# Altium project US_EMG_PROTO1.PrjPcb
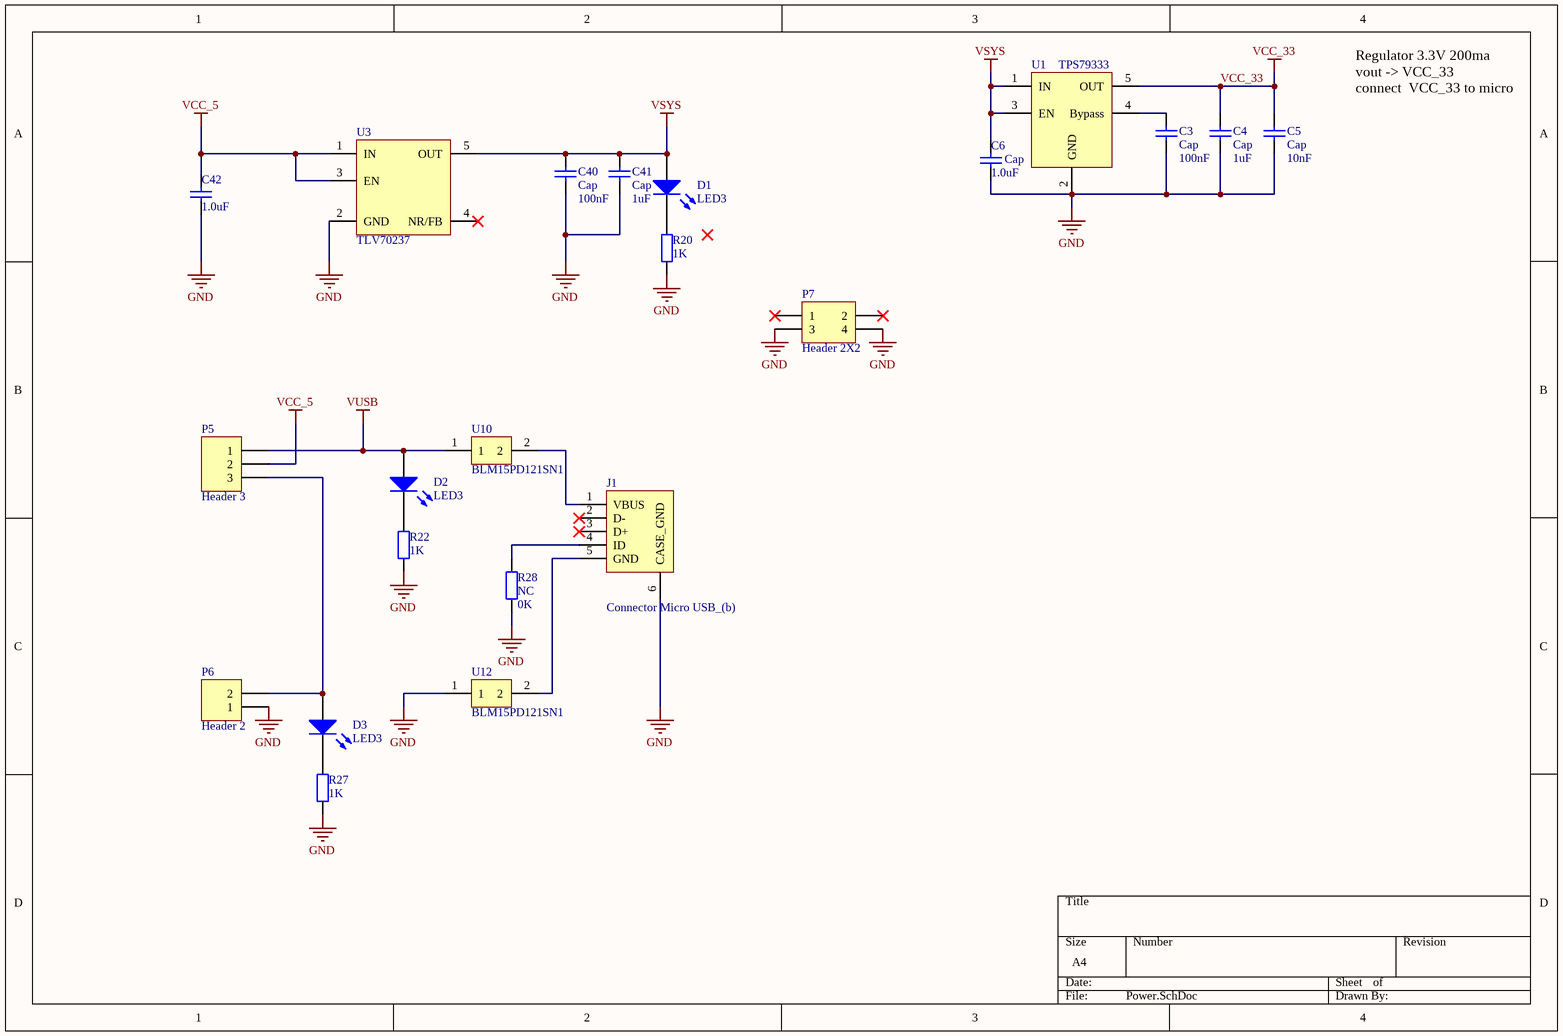
[diagram p0: Power.SchDoc]
4 sheets, 141 parts. Net scope: flat (ports and power ports of the same name join across sheets).
Board file: PCB2_DEMO_BOARD.PcbDoc
Sheets:
  Power.SchDoc
  Power_Cerebro.SchDoc
  ADS1298_2.SchDoc
  Cerebro.SchDoc

## Sheet Power.SchDoc
size A4

### Parts
C3  Cap  value 100nF  [cap_0402_R - modified]
C4  Cap  value 1uF  [cap_0402_R - modified]
C5  Cap  value 10nF  [cap_0402_R - modified]
C6  Cap  value 1.0uF  [cap_0402_R - modified]
C40  Cap  value 100nF  [cap_0402_R - modified]
C41  Cap  value 1uF  [cap_0402_R - modified]
C42  value 1.0uF  [cap_0402_R - modified]  (hidden comment: Cap)
D1  LED3  [0603]
D2  LED3  [0603]
D3  LED3  [0603]
J1  Connector Micro USB_(b)  [CONNECTOR_MICRO_USB_B_TYPE]
P5  Header 3  [HDR1X3]
P6  Header 2  [HDR1X2]
P7  Header 2X2  [HDR2X2]
R20  value 1K  [0603]  (hidden comment: R)
R22  value 1K  [0603]  (hidden comment: R)
R27  value 1K  [0603]  (hidden comment: R)
R28  NC  value 0K  [cap_0402_R - modified]
U1  TPS79333  [SOT_23__DBV_(R - PDSO - G5)]
U3  TLV70237  [SOT23__DDC__(R - PDSO-  G5)]
U10  BLM15PD121SN1  [BLM15PD121SN1]
U12  BLM15PD121SN1  [BLM15PD121SN1]

### Nets
GND: C3.1 C4.2 C5.1 C6.1 C40.1 C41.2 C42.1 J1.6(CASE_GND) P6.1 P7.3 P7.4 R20.1 R22.1 R27.1 R28.1 U1.2(GND) U3.2(GND) U12.1
VCC_5: C42.2 P5.2 U3.1(IN) U3.3(EN)
VCC_33: C4.1 C5.2 U1.5(OUT)
VSYS: C6.2 C40.2 C41.1 D1.1(A) U1.1(IN) U1.3(EN) U3.5(OUT)
VUSB: D2.1(A) P5.1 U10.1
NetC3_2: C3.2 U1.4(Bypass)
NetD1_2: D1.2(K) R20.2
NetD2_2: D2.2(K) R22.2
NetD3_1: D3.1(A) P5.3 P6.2
NetD3_2: D3.2(K) R27.2
NetJ1_1: J1.1(VBUS) U10.2
NetJ1_4: J1.4(ID) R28.2
NetJ1_5: J1.5(GND) U12.2

Not connected (* = marked no-connect by the designer): J1 2(D-)* 3(D+)*; P7 1* 2*; U3 4(NR/FB)*

### Notes on the sheet
- Regulator 3.3V 200ma
  vout -> VCC_33
  connect  VCC_33 to micro

### Library data of the parts
C3-C6 C40-C42 = Cap: Capacitor; Published: 8-Jun-2000; LatestRevisionDate: 17-Jul-2002; LatestRevisionNote: Re-released for DXP Platform.; PackageReference: RAD-0.3; Publisher: Altium Limited; PackageDescription: Radial Cap, Thru-Hole; 2 Leads; 0.3 in Pin Spacing
D1-D3 = LED3: Typical BLUE SiC LED; Published: 8-Jun-2000; LatestRevisionDate: 17-Dec-2003; LatestRevisionNote: PCB Footprint replaced.; DatasheetVersion: 16-Apr-2002; PackageVersion: 16-Apr-2002; PackageReference: 3.5X2.8X1.9; Publisher: Altium Limited; PackageDescription: SM LED; 2 C-Bend Leads; Body 3.5 x 2.8 x 1.9 mm, inc leads (LxWxH typ)
J1 = Connector Micro USB_(b): CONNECTOR MICRO USB
P5 = Header 3: Header, 3-Pin; LatestRevisionDate: 17-Jul-2002; LatestRevisionNote: Re-released for DXP Platform.; Publisher: Altium Limited
P6 = Header 2: Header, 2-Pin; LatestRevisionDate: 17-Jul-2002; LatestRevisionNote: Re-released for DXP Platform.; Publisher: Altium Limited
P7 = Header 2X2: Header, 2-Pin, Dual row; LatestRevisionDate: 17-Jul-2002; LatestRevisionNote: Re-released for DXP Platform.; Publisher: Altium Limited
R20 R22 R27 R28 = Res2: Resistor; Published: 8-Jun-2000; LatestRevisionDate: 17-Jul-2002; LatestRevisionNote: Re-released for DXP Platform.; PackageReference: AXIAL-0.4; Publisher: Altium Limited; PackageDescription: Axial Device, Thru-Hole; 2 Leads; 0.4 in Pin Spacing
U1 = TPS79333: Regulator
U3 = TLV70237: Linear Regulator

## Sheet Power_Cerebro.SchDoc
size A4
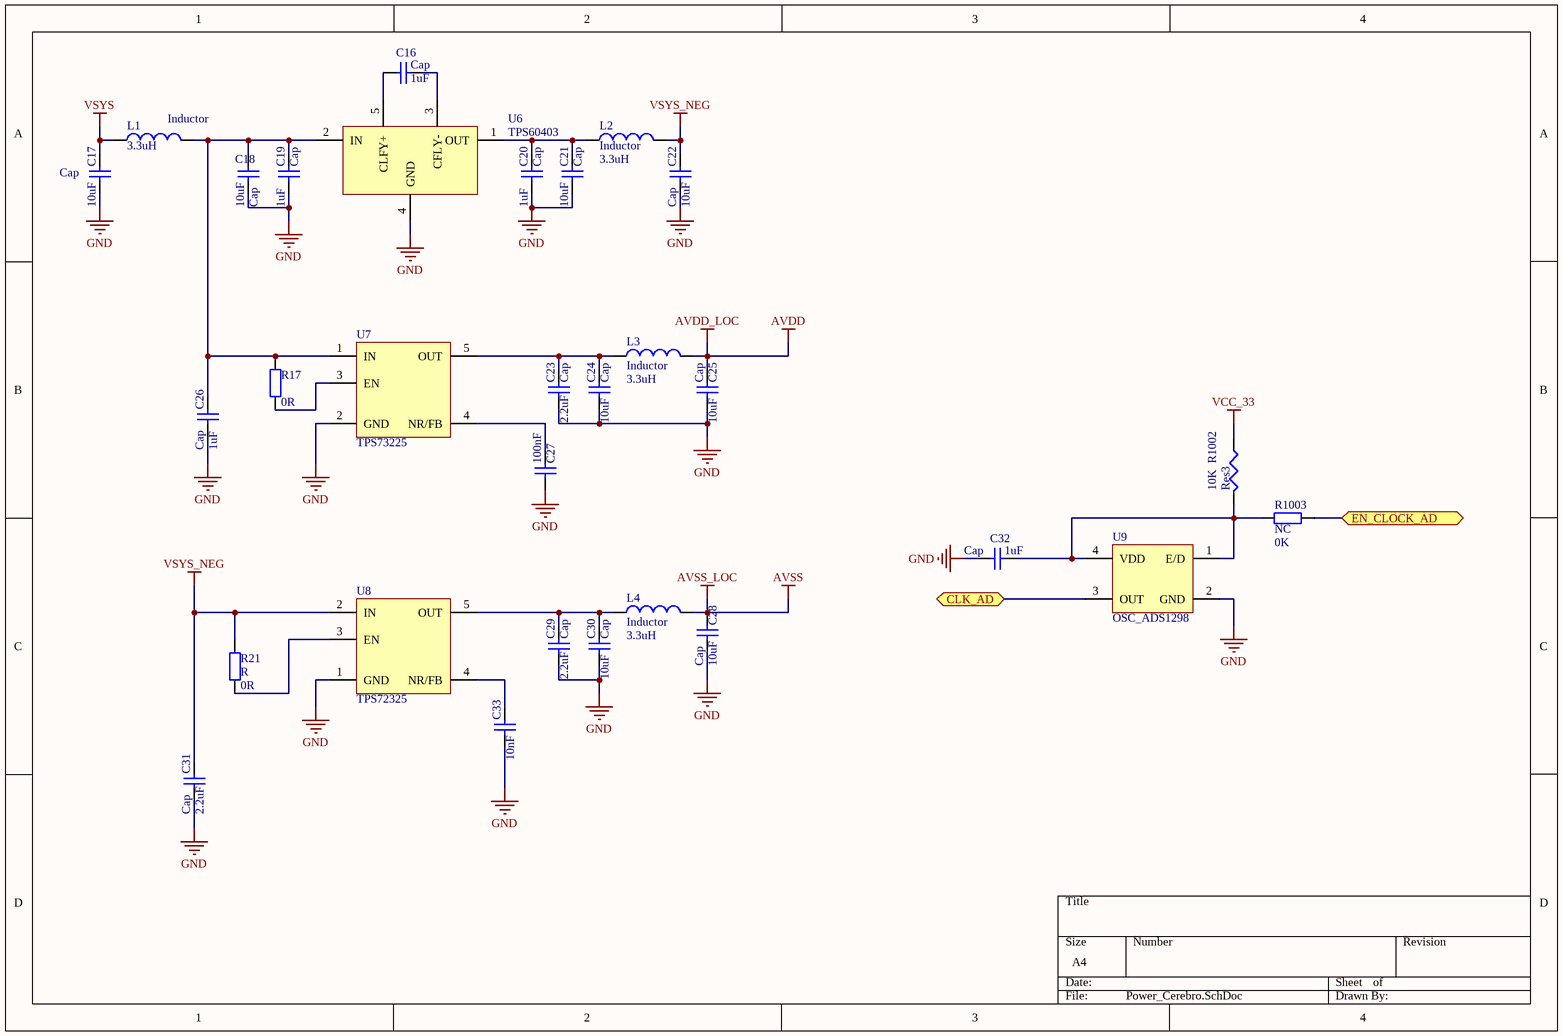
[diagram p1: Power_Cerebro.SchDoc]

### Parts
C16  Cap  value 1uF  [cap_0402_R - modified]
C17  Cap  value 10uF  [cap_0402_R - modified]
C18  Cap  value 10uF  [cap_0402_R - modified]
C19  Cap  value 1uF  [cap_0402_R - modified]
C20  Cap  value 1uF  [cap_0402_R - modified]
C21  Cap  value 10uF  [cap_0402_R - modified]
C22  Cap  value 10uF  [cap_0402_R - modified]
C23  Cap  value 2.2uF  [cap_0402_R - modified]
C24  Cap  value 10uF  [cap_0402_R - modified]
C25  Cap  value 10uF  [cap_0402_R - modified]
C26  Cap  value 1uF  [cap_0402_R - modified]
C27  value 100nF  [cap_0402_R - modified]  (hidden comment: C)
C28  Cap  value 10uF  [cap_0402_R - modified]
C29  Cap  value 2.2uF  [cap_0402_R - modified]
C30  Cap  value 10uF  [cap_0402_R - modified]
C31  Cap  value 2.2uF  [cap_0402_R - modified]
C32  Cap  value 1uF  [cap_0402_R - modified]
C33  value 10nF  [cap_0402_R - modified]  (hidden comment: C)
L1  Inductor  value 3.3uH  [0603]
L2  Inductor  value 3.3uH  [0603]
L3  Inductor  value 3.3uH  [0603]
L4  Inductor  value 3.3uH  [0603]
R17  value 0R  [cap_0402_R - modified]  (hidden comment: R)
R21  R  value 0R  [cap_0402_R - modified]
R1002  Res3  value 10K  [res_0402_R - modified]
R1003  NC  value 0K  [cap_0402_R - modified]
U6  TPS60403  [SOT_23__DBV_(R - PDSO - G5)]
U7  TPS73225  [SOT23__DDC__(R - PDSO-  G5)]
U8  TPS72325  [SOT23__DDC__(R - PDSO-  G5)]
U9  OSC_ADS1298  [HC735 - OSC ADS1298]

### Ports
CLK_AD (bidir), EN_CLOCK_AD (bidir)

### Nets
AVDD: C25.1 L3.2  [also labelled AVDD_LOC]
AVSS: C28.1 L4.2  [also labelled AVSS_LOC]
GND: C17.2 C18.2 C19.2 C20.2 C21.2 C22.2 C23.2 C24.2 C25.2 C26.2 C27.2 C28.2 C29.2 C30.2 C31.2 C32.2 C33.2 U6.4(GND) U7.2(GND) U8.1(GND) U9.2(GND)
VCC_33: R1002.1
VSYS: C17.1 L1.1
VSYS_NEG: C22.1 C31.1 L2.2 R21.1 U8.2(IN)
NetC16_1: C16.1 U6.3(CFLY-)
NetC16_2: C16.2 U6.5(CLFY+)
NetC18_1: C18.1 C19.1 C26.1 L1.2 R17.2 U6.2(IN) U7.1(IN)
NetC20_1: C20.1 C21.1 L2.1 U6.1(OUT)
NetC23_1: C23.1 C24.1 L3.1 U7.5(OUT)
NetC27_1: C27.1 U7.4(NR/FB)
NetC29_1: C29.1 C30.1 L4.1 U8.5(OUT)
NetC32_1: C32.1 R1002.2 R1003.2 U9.1(E/D) U9.4(VDD)
NetC33_1: C33.1 U8.4(NR/FB)
NetP2_12: R1003.1 ; port EN_CLOCK_AD
NetR17_1: R17.1 U7.3(EN)
NetR21_2: R21.2 U8.3(EN)
NetU9_3: U9.3(OUT) ; port CLK_AD

### Library data of the parts
C16-C33 = Cap: Capacitor; Published: 8-Jun-2000; LatestRevisionDate: 17-Jul-2002; LatestRevisionNote: Re-released for DXP Platform.; PackageReference: RAD-0.3; Publisher: Altium Limited; PackageDescription: Radial Cap, Thru-Hole; 2 Leads; 0.3 in Pin Spacing
L1-L4 = Inductor: Code_IEC: 1005; Published: 8-Jun-2000; LatestRevisionDate: 29-May-2009; LatestRevisionNote: IPC-7351 Footprint Added.; PackageReference: 0402-A; Publisher: Altium Limited; PackageDescription: Chip Inductor; Code_JEITA: 0402
R17 R21 R1003 = Res2: Resistor; Published: 8-Jun-2000; LatestRevisionDate: 17-Jul-2002; LatestRevisionNote: Re-released for DXP Platform.; PackageReference: AXIAL-0.4; Publisher: Altium Limited; PackageDescription: Axial Device, Thru-Hole; 2 Leads; 0.4 in Pin Spacing
R1002 = Res3: Resistor; Published: 8-Jun-2000; LatestRevisionDate: 29-May-2009; LatestRevisionNote: IPC-7351 Footprint Added.; PackageReference: J1-0603; Publisher: Altium Limited; PackageDescription: Chip Resistor
U6 = TPS60403: Linear Regulator
U7 = TPS73225: Linear Regulator
U8 = TPS72325: Linear Regulator
U9 = OSC_ADS1298: Linear Regulator

## Sheet ADS1298_2.SchDoc
size A4
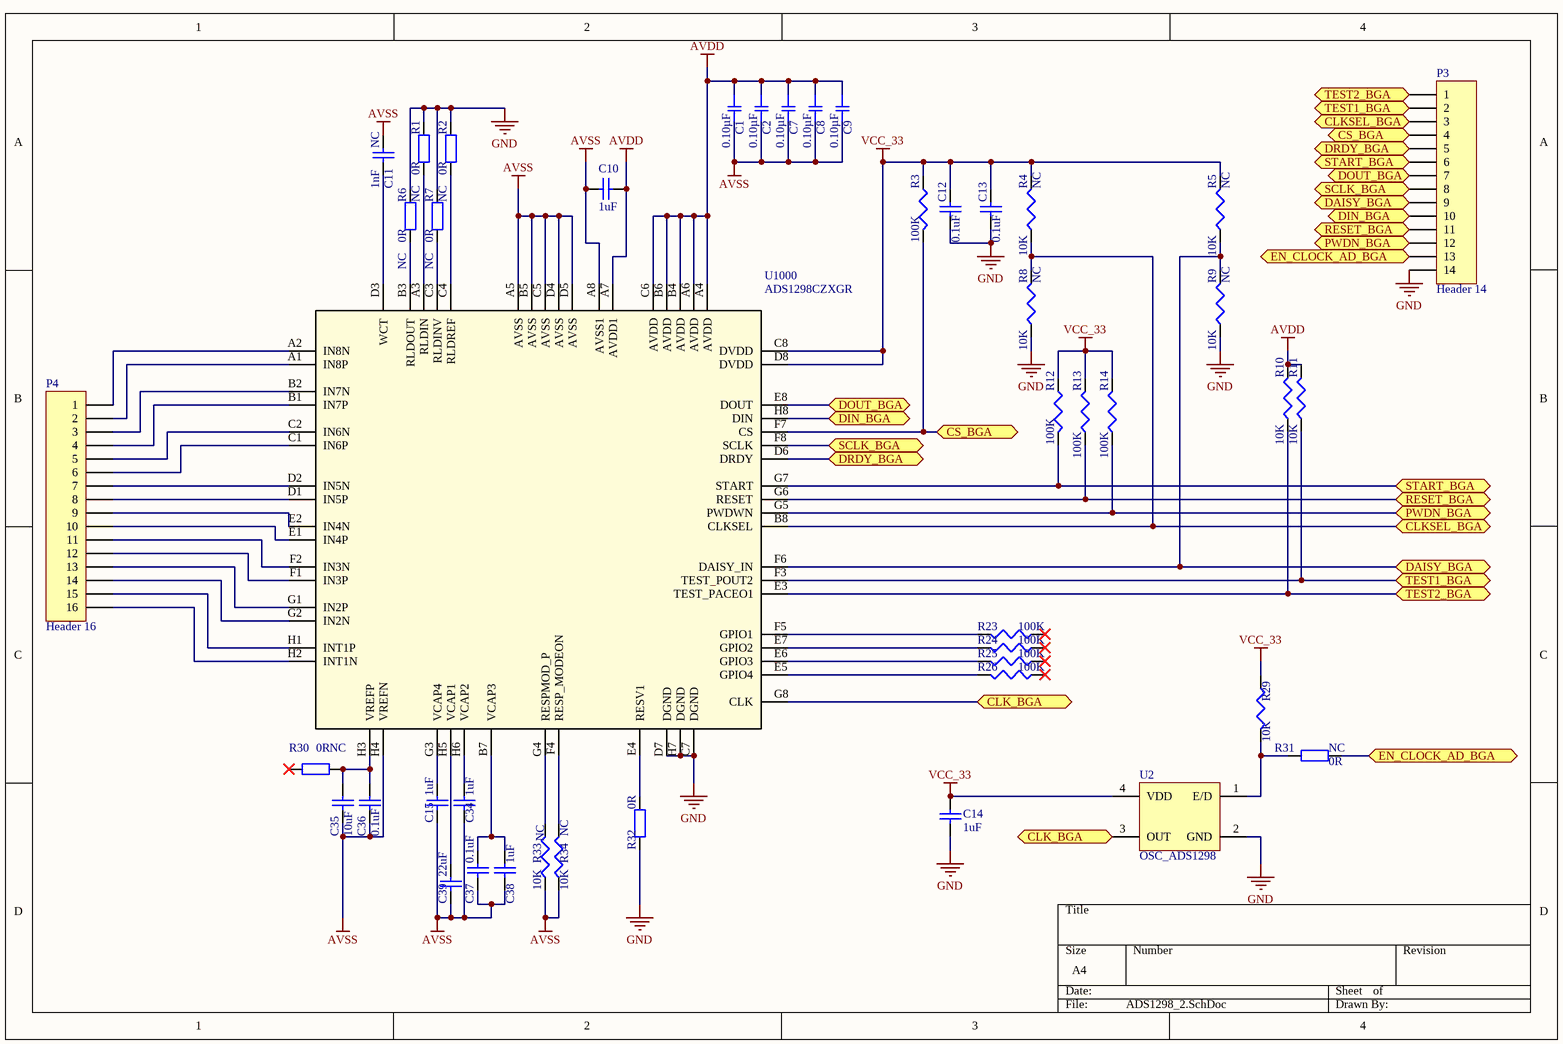
[diagram p2: ADS1298_2.SchDoc]

### Parts
C1  0.10µF  [SMD-0201C]
C2  0.10µF  [SMD-0201C]
C7  0.10µF  [SMD-0201C]
C8  0.10µF  [SMD-0201C]
C9  0.10µF  [SMD-0201C]
C10  value 1uF  [cap_0402_R - modified]  (hidden comment: Cap)
C11  NC  value 1nF  [cap_0402_R - modified]
C12  value 0.1uF  [cap_0402_R - modified]  (hidden comment: Cap)
C13  value 0.1uF  [cap_0402_R - modified]  (hidden comment: Cap)
C14  value 1uF  [cap_0402_R - modified]  (hidden comment: Cap)
C15  value 1uF  [cap_0402_R - modified]  (hidden comment: Cap)
C34  value 1uF  [cap_0402_R - modified]  (hidden comment: Cap)
C35  value 10uF  [cap_0402_R - modified]  (hidden comment: Cap)
C36  value 0.1uF  [cap_0402_R - modified]  (hidden comment: Cap)
C37  value 0.1uF  [cap_0402_R - modified]  (hidden comment: Cap)
C38  value 1uF  [cap_0402_R - modified]  (hidden comment: Cap)
C39  value 22uF  [cap_0402_R - modified]  (hidden comment: Cap)
P3  Header 14  [61301421121]
P4  Header 16  [61301621121]
R1  NC  value 0R  [cap_0402_R - modified]
R2  NC  value 0R  [cap_0402_R - modified]
R3  value 100K  [res_0402_R - modified]  (hidden comment: Res3)
R4  NC  value 10K  [cap_0402_R - modified]
R5  NC  value 10K  [cap_0402_R - modified]
R6  NC  value 0R  [cap_0402_R - modified]
R7  NC  value 0R  [cap_0402_R - modified]
R8  NC  value 10K  [cap_0402_R - modified]
R9  NC  value 10K  [cap_0402_R - modified]
R10  value 10K  [cap_0402_R - modified]
R11  value 10K  [cap_0402_R - modified]
R12  value 100K  [res_0402_R - modified]  (hidden comment: Res3)
R13  value 100K  [res_0402_R - modified]  (hidden comment: Res3)
R14  value 100K  [res_0402_R - modified]  (hidden comment: Res3)
R23  value 100K  [res_0402_R - modified]  (hidden comment: Res3)
R24  value 100K  [res_0402_R - modified]  (hidden comment: Res3)
R25  value 100K  [res_0402_R - modified]  (hidden comment: Res3)
R26  value 100K  [res_0402_R - modified]  (hidden comment: Res3)
R29  value 10K  [res_0402_R - modified]  (hidden comment: Res3)
R30  NC  value 0R  [cap_0402_R - modified]
R31  NC  value 0R  [cap_0402_R - modified]
R32  value 0R  [cap_0402_R - modified]
R33  NC  value 10K  [cap_0402_R - modified]
R34  NC  value 10K  [res_0402_R - modified]
U2  OSC_ADS1298  [HC735 - OSC ADS1298]
U1000  ADS1298CZXGR  [BGA64C80P8X8_800X800X106]

### Ports
CLK_BGA, CLKSEL_BGA, CS_BGA, DAISY_BGA, DIN_BGA, DOUT_BGA, DRDY_BGA, EN_CLOCK_AD_BGA (bidir), PWDN_BGA, RESET_BGA, SCLK_BGA, START_BGA, TEST1_BGA, TEST2_BGA

### Nets
AVDD: C1.1 C2.1 C7.1 C8.1 C9.1 C10.1 R10.2 R11.2 U1000.A4(AVDD) U1000.A6(AVDD) U1000.A7(AVDD1) U1000.B4(AVDD) U1000.B6(AVDD) U1000.C6(AVDD)
AVSS: C1.2 C2.2 C7.2 C8.2 C9.2 C10.2 C11.1 C15.1 C34.1 C35.1 C36.1 C37.1 C38.1 C39.1 R33.1 R34.1 U1000.A5(AVSS) U1000.A8(AVSS1) U1000.B5(AVSS) U1000.C5(AVSS) U1000.D4(AVSS) U1000.D5(AVSS) U1000.H4(VREFN)
GND: C12.1 C13.1 C14.2 P3.14 R1.1 R2.1 R6.1 R7.1 R8.1 R9.1 R32.2 U2.2(GND) U1000.C7(DGND) U1000.D7(DGND) U1000.H7(DGND)
VCC_33: C12.2 C13.2 C14.1 R3.1 R4.2 R5.2 R12.1 R13.2 R14.2 R29.1 U2.4(VDD) U1000.C8(DVDD) U1000.D8(DVDD)
NetC11_2: C11.2 U1000.D3(WCT)
NetC15_2: C15.2 U1000.G3(VCAP4)
NetC34_2: C34.2 U1000.H6(VCAP2)
NetC35_2: C35.2 C36.2 R30.2 U1000.H3(VREFP)
NetC37_2: C37.2 C38.2 U1000.B7(VCAP3)
NetC39_2: C39.2 U1000.H5(VCAP1)
NetP3_1: P3.1 R10.1 U1000.E3(TEST_PACEO1) ; port TEST2_BGA
NetP3_2: P3.2 R11.1 U1000.F3(TEST_POUT2) ; port TEST1_BGA
NetP3_3: P3.3 R4.1 R8.2 U1000.B8(CLKSEL) ; port CLKSEL_BGA
NetP3_4: P3.4 R3.2 U1000.F7(CS) ; port CS_BGA
NetP3_5: P3.5 U1000.D6(DRDY) ; port DRDY_BGA
NetP3_6: P3.6 R12.2 U1000.G7(START) ; port START_BGA
NetP3_7: P3.7 U1000.E8(DOUT) ; port DOUT_BGA
NetP3_8: P3.8 U1000.F8(SCLK) ; port SCLK_BGA
NetP3_9: P3.9 R5.1 R9.2 U1000.F6(DAISY_IN) ; port DAISY_BGA
NetP3_10: P3.10 U1000.H8(DIN) ; port DIN_BGA
NetP3_11: P3.11 R13.1 U1000.G6(RESET) ; port RESET_BGA
NetP3_12: P3.12 R14.1 U1000.G5(PWDWN) ; port PWDN_BGA
NetP3_13: P3.13 R31.1 ; port EN_CLOCK_AD_BGA
NetP4_1: P4.1 U1000.A2(IN8N)
NetP4_2: P4.2 U1000.A1(IN8P)
NetP4_3: P4.3 U1000.B2(IN7N)
NetP4_4: P4.4 U1000.B1(IN7P)
NetP4_5: P4.5 U1000.C2(IN6N)
NetP4_6: P4.6 U1000.C1(IN6P)
NetP4_7: P4.7 U1000.D2(IN5N)
NetP4_8: P4.8 U1000.D1(IN5P)
NetP4_9: P4.9 U1000.E2(IN4N)
NetP4_10: P4.10 U1000.E1(IN4P)
NetP4_11: P4.11 U1000.F2(IN3N)
NetP4_12: P4.12 U1000.F1(IN3P)
NetP4_13: P4.13 U1000.G1(IN2P)
NetP4_14: P4.14 U1000.G2(IN2N)
NetP4_15: P4.15 U1000.H1(INT1P)
NetP4_16: P4.16 U1000.H2(INT1N)
NetR1_2: R1.2 U1000.A3(RLDIN)
NetR2_2: R2.2 U1000.C4(RLDREF)
NetR6_2: R6.2 U1000.B3(RLDOUT)
NetR7_2: R7.2 U1000.C3(RLDINV)
NetR23_2: R23.2 U1000.F5(GPIO1)
NetR24_2: R24.2 U1000.E7(GPIO2)
NetR25_2: R25.2 U1000.E6(GPIO3)
NetR26_2: R26.2 U1000.E5(GPIO4)
NetR29_2: R29.2 R31.2 U2.1(E/D)
NetR32_1: R32.1 U1000.E4(RESV1)
NetR33_2: R33.2 U1000.G4(RESPMOD_P)
NetR34_2: R34.2 U1000.F4(RESP_MODEON)
NetU2_3: U2.3(OUT) U1000.G8(CLK) ; port CLK_BGA

Not connected (* = marked no-connect by the designer): R23 1*; R24 1*; R25 1*; R26 1*; R30 1*

### Library data of the parts
C1 C2 C7-C9 = GRT033C81A104KE01D: CAP CER 0.1UF 10V X6S 0201; Manufacturer: Murata Electronics North America; Factory Stock: 0; Unit Price (USD): 0.1; Minimum Quantity: 1; Tolerance: ±10%; Datasheets: http://search.murata.co.jp/Ceramy/image/img/A01X/G101/ENG/GRT033C81A104KE01-01.pdf; Image: //media.digikey.com/Renders/Murata%20Renders/GRT%20Series%200201%20(0603%20Metric).jpg; Digi-Key Part Number: 490-12232-1-ND; Part Number: GRT033C81A104KE01D; Quantity Available: 1647; @ qty: 0; Packaging: Cut Tape (CT); Series: GRT; Part Status: Active; Value: 0.10µF; Voltage: 10V; Temperature Coefficient: X6S; Operating Temperature: -55°C ~ 105°C; Features: -; Ratings: AEC-Q200; Applications: Automotive; Failure Rate: Surface Mount, MLCC; Mounting Type: 0201 (0603 Metric); Package / Case: 0.024" L x 0.012" W (0.60mm x 0.30mm); Size / Dimension: -; Height - Seated (Max): 0.013" (0.33mm); Thickness (Max): -; Lead Spacing: -
C10-C15 C34-C39 = Cap: Capacitor; Published: 8-Jun-2000; LatestRevisionDate: 17-Jul-2002; LatestRevisionNote: Re-released for DXP Platform.; PackageReference: RAD-0.3; Publisher: Altium Limited; PackageDescription: Radial Cap, Thru-Hole; 2 Leads; 0.3 in Pin Spacing
P3 = Header 14: Header, 14-Pin; LatestRevisionDate: 17-Jul-2002; LatestRevisionNote: Re-released for DXP Platform.; Publisher: Altium Limited
P4 = Header 16: Header, 16-Pin; LatestRevisionDate: 17-Jul-2002; LatestRevisionNote: Re-released for DXP Platform.; Publisher: Altium Limited
R1 R2 R6 R7 R30-R32 = Res2: Resistor; Published: 8-Jun-2000; LatestRevisionDate: 17-Jul-2002; LatestRevisionNote: Re-released for DXP Platform.; PackageReference: AXIAL-0.4; Publisher: Altium Limited; PackageDescription: Axial Device, Thru-Hole; 2 Leads; 0.4 in Pin Spacing
R3-R5 R8-R14 R23-R26 R29 R33 R34 = Res3: Resistor; Published: 8-Jun-2000; LatestRevisionDate: 29-May-2009; LatestRevisionNote: IPC-7351 Footprint Added.; PackageReference: J1-0603; Publisher: Altium Limited; PackageDescription: Chip Resistor
U2 = OSC_ADS1298: Linear Regulator
U1000 = ADS1298CZXGR: 8-Channel, 24-Bit Analog-To-Digital Converter With Integrated ECG Front End; Manufacturer: Texas Instruments; INDUSTRY_STD_PKG_TYPE: NFBGA; FAMILY_NAME: ECG / EEG Analog Front End; PIN_COUNT: 64; PACKAGE_DESIGNATOR: ZXG; Datasheet_URL: http://www.ti.com/lit/gpn/ADS1298; GENERIC_PART_NUMBER: ADS1298; Copyright: Copyright (C) 2018 Accelerated Designs. All rights reserved; RefDes: RefDes; Type: DEV

## Sheet Cerebro.SchDoc
size A4
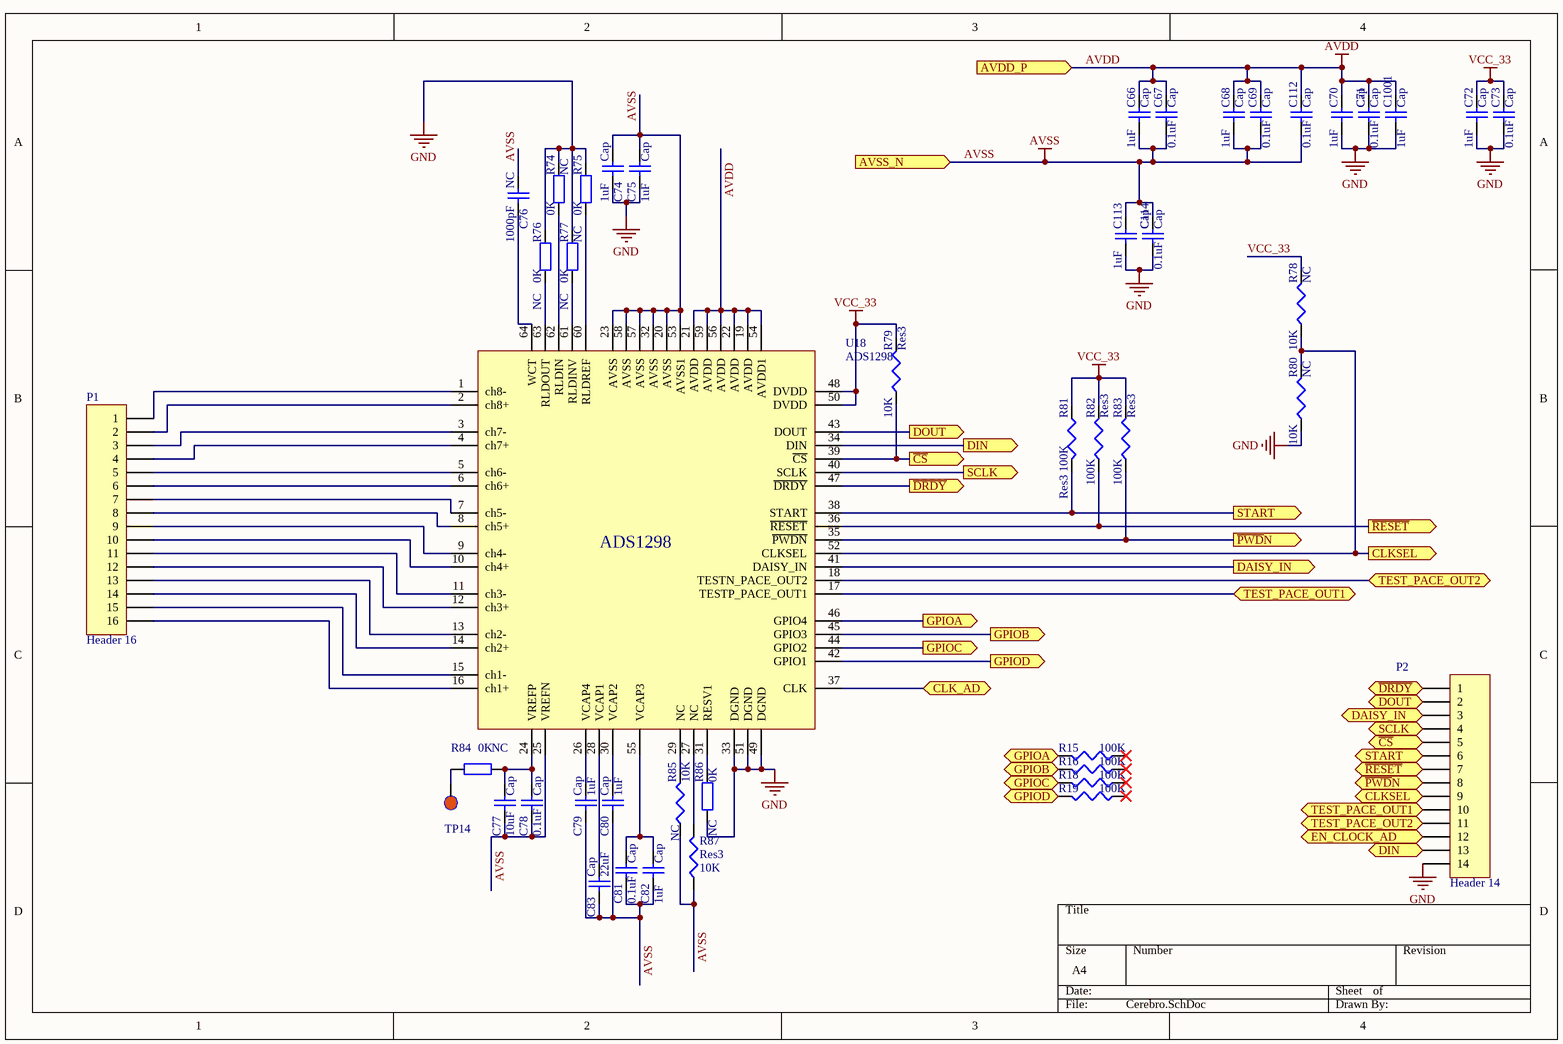
[diagram p3: Cerebro.SchDoc]

### Parts
C66  Cap  value 1uF  [cap_0402_R - modified]
C67  Cap  value 0.1uF  [cap_0402_R - modified]
C68  Cap  value 1uF  [cap_0402_R - modified]
C69  Cap  value 0.1uF  [cap_0402_R - modified]
C70  Cap  value 1uF  [cap_0402_R - modified]
C71  Cap  value 0.1uF  [cap_0402_R - modified]
C72  Cap  value 1uF  [cap_0402_R - modified]
C73  Cap  value 0.1uF  [cap_0402_R - modified]
C74  Cap  value 1uF  [cap_0402_R - modified]
C75  Cap  value 1uF  [cap_0402_R - modified]
C76  NC  value 1000pF  [cap_0402_R - modified]
C77  Cap  value 10uF  [cap_0402_R - modified]
C78  Cap  value 0.1uF  [cap_0402_R - modified]
C79  Cap  value 1uF  [cap_0402_R - modified]
C80  Cap  value 1uF  [cap_0402_R - modified]
C81  Cap  value 0.1uF  [cap_0402_R - modified]
C82  Cap  value 1uF  [cap_0402_R - modified]
C83  Cap  value 22uF  [cap_0402_R - modified]
C112  Cap  value 0.1uF  [cap_0402_R - modified]
C113  Cap  value 1uF  [cap_0402_R - modified]
C114  Cap  value 0.1uF  [cap_0402_R - modified]
C1001  Cap  value 1uF  [cap_0402_R - modified]
P1  Header 16  [61301621121]
P2  Header 14  [61301421121]
R15  value 100K  [res_0402_R - modified]  (hidden comment: Res3)
R16  value 100K  [res_0402_R - modified]  (hidden comment: Res3)
R18  value 100K  [res_0402_R - modified]  (hidden comment: Res3)
R19  value 100K  [res_0402_R - modified]  (hidden comment: Res3)
R74  NC  value 0K  [cap_0402_R - modified]
R75  NC  value 0K  [cap_0402_R - modified]
R76  NC  value 0K  [cap_0402_R - modified]
R77  NC  value 0K  [cap_0402_R - modified]
R78  NC  value 10K  [cap_0402_R - modified]
R79  Res3  value 10K  [res_0402_R - modified]
R80  NC  value 10K  [cap_0402_R - modified]
R81  Res3  value 100K  [res_0402_R - modified]
R82  Res3  value 100K  [res_0402_R - modified]
R83  Res3  value 100K  [res_0402_R - modified]
R84  NC  value 0K  [cap_0402_R - modified]
R85  NC  value 10K  [cap_0402_R - modified]
R86  NC  value 0K  [cap_0402_R - modified]
R87  Res3  value 10K  [res_0402_R - modified]
TP14  1-PIN  [Testpt_055]  (value not drawn)
U18  ADS1298  [S-PQFP - G64 - ADS1298]

### Ports
AVDD_P (in), AVSS_N (in), CLK_AD (bidir), CLKSEL (out), DAISY_IN (out), DIN (out), DOUT (out), EN_CLOCK_AD (bidir), GPIOA (out), GPIOB (out), GPIOC (out), GPIOD (out), SCLK (out), START (out), TEST_PACE_OUT1 (bidir), TEST_PACE_OUT2 (bidir), ~{CS} (out), ~{DRDY} (out), ~{PWD}N (out), ~{RESET} (out)

### Nets
AVDD: C66.2 C67.2 C68.2 C69.2 C70.2 C71.2 C112.2 C1001.2 U18.19(AVDD) U18.21(AVDD) U18.22(AVDD) U18.54(AVDD1) U18.56(AVDD) U18.59(AVDD) ; port AVDD_P
AVSS: C66.1 C67.1 C68.1 C69.1 C74.1 C75.1 C76.1 C77.1 C78.1 C79.1 C80.1 C81.1 C82.1 C83.1 C112.1 C113.2 C114.2 R85.1 R87.1 U18.20(AVSS) U18.23(AVSS) U18.25(VREFN) U18.32(AVSS) U18.53(AVSS1) U18.57(AVSS) U18.58(AVSS) ; port AVSS_N
GND: C70.1 C71.1 C72.1 C73.1 C74.2 C75.2 C113.1 C114.1 C1001.1 P2.14 R74.1 R75.1 R76.1 R77.1 R80.1 R86.2 U18.33(DGND) U18.49(DGND) U18.51(DGND)
VCC_33: C72.2 C73.2 R78.2 R79.2 R81.1 R82.2 R83.2 U18.48(DVDD) U18.50(DVDD)
NetC76_2: C76.2 U18.64(WCT)
NetC77_2: C77.2 C78.2 R84.2 U18.24(VREFP)
NetC79_2: C79.2 U18.26(VCAP4)
NetC80_2: C80.2 U18.30(VCAP2)
NetC81_2: C81.2 C82.2 U18.55(VCAP3)
NetC83_2: C83.2 U18.28(VCAP1)
NetP1_1: P1.1 U18.1(ch8-)
NetP1_2: P1.2 U18.2(ch8+)
NetP1_3: P1.3 U18.3(ch7-)
NetP1_4: P1.4 U18.4(ch7+)
NetP1_5: P1.5 U18.5(ch6-)
NetP1_6: P1.6 U18.6(ch6+)
NetP1_7: P1.7 U18.7(ch5-)
NetP1_8: P1.8 U18.8(ch5+)
NetP1_9: P1.9 U18.9(ch4-)
NetP1_10: P1.10 U18.10(ch4+)
NetP1_11: P1.11 U18.11(ch3-)
NetP1_12: P1.12 U18.12(ch3+)
NetP1_13: P1.13 U18.13(ch2-)
NetP1_14: P1.14 U18.14(ch2+)
NetP1_15: P1.15 U18.15(ch1-)
NetP1_16: P1.16 U18.16(ch1+)
NetP2_1: P2.1 U18.47(~{DRDY}) ; port ~{DRDY}
NetP2_2: P2.2 U18.43(DOUT) ; port DOUT
NetP2_3: P2.3 U18.41(DAISY_IN) ; port DAISY_IN
NetP2_4: P2.4 U18.40(SCLK) ; port SCLK
NetP2_5: P2.5 R79.1 U18.39(~{CS}) ; port ~{CS}
NetP2_6: P2.6 R81.2 U18.38(START) ; port START
NetP2_7: P2.7 R82.1 U18.36(~{RESET}) ; port ~{RESET}
NetP2_8: P2.8 R83.1 U18.35(~{PWDN}) ; port ~{PWD}N
NetP2_9: P2.9 R78.1 R80.2 U18.52(CLKSEL) ; port CLKSEL
NetP2_10: P2.10 U18.17(TESTP_PACE_OUT1) ; port TEST_PACE_OUT1
NetP2_11: P2.11 U18.18(TESTN_PACE_OUT2) ; port TEST_PACE_OUT2
NetP2_12: P2.12 ; port EN_CLOCK_AD
NetP2_13: P2.13 U18.34(DIN) ; port DIN
NetR15_2: R15.2 U18.46(GPIO4) ; port GPIOA
NetR16_2: R16.2 U18.45(GPIO3) ; port GPIOB
NetR18_2: R18.2 U18.44(GPIO2) ; port GPIOC
NetR19_2: R19.2 U18.42(GPIO1) ; port GPIOD
NetR74_2: R74.2 U18.62(RLDIN)
NetR75_2: R75.2 U18.60(RLDREF)
NetR76_2: R76.2 U18.63(RLDOUT)
NetR77_2: R77.2 U18.61(RLDINV)
NetR84_1: R84.1 TP14.1
NetR85_2: R85.2 U18.29(NC)
NetR86_1: R86.1 U18.31(RESV1)
NetR87_2: R87.2 U18.27(NC)
NetU9_3: U18.37(CLK) ; port CLK_AD

Not connected (* = marked no-connect by the designer): R15 1*; R16 1*; R18 1*; R19 1*

### Library data of the parts
C66-C83 C112-C114 C1001 = Cap: Capacitor; Published: 8-Jun-2000; LatestRevisionDate: 17-Jul-2002; LatestRevisionNote: Re-released for DXP Platform.; PackageReference: RAD-0.3; Publisher: Altium Limited; PackageDescription: Radial Cap, Thru-Hole; 2 Leads; 0.3 in Pin Spacing
P1 = Header 16: Header, 16-Pin; LatestRevisionDate: 17-Jul-2002; LatestRevisionNote: Re-released for DXP Platform.; Publisher: Altium Limited
P2 = Header 14: Header, 14-Pin; LatestRevisionDate: 17-Jul-2002; LatestRevisionNote: Re-released for DXP Platform.; Publisher: Altium Limited
R15 R16 R18 R19 R78-R83 R85 R87 = Res3: Resistor; Published: 8-Jun-2000; LatestRevisionDate: 29-May-2009; LatestRevisionNote: IPC-7351 Footprint Added.; PackageReference: J1-0603; Publisher: Altium Limited; PackageDescription: Chip Resistor
R74-R77 R84 R86 = Res2: Resistor; Published: 8-Jun-2000; LatestRevisionDate: 17-Jul-2002; LatestRevisionNote: Re-released for DXP Platform.; PackageReference: AXIAL-0.4; Publisher: Altium Limited; PackageDescription: Axial Device, Thru-Hole; 2 Leads; 0.4 in Pin Spacing

## Nets that join several sheets
AVDD: Power_Cerebro (C25.1 L3.2), ADS1298_2 (14 pins), Cerebro (14 pins)
AVSS: Power_Cerebro (C28.1 L4.2), ADS1298_2 (23 pins), Cerebro (26 pins)
GND: Power (18 pins), Power_Cerebro (21 pins), ADS1298_2 (15 pins), Cerebro (19 pins)
VCC_33: Power (C4.1 C5.2 U1.5), Power_Cerebro (R1002.1), ADS1298_2 (13 pins), Cerebro (9 pins)
VSYS: Power (7 pins), Power_Cerebro (C17.1 L1.1)
NetP2_12: Power_Cerebro (R1003.1), Cerebro (P2.12)
NetU9_3: Power_Cerebro (U9.3), Cerebro (U18.37)